# EAGLE design BigTime (EAGLE 9.3.0)
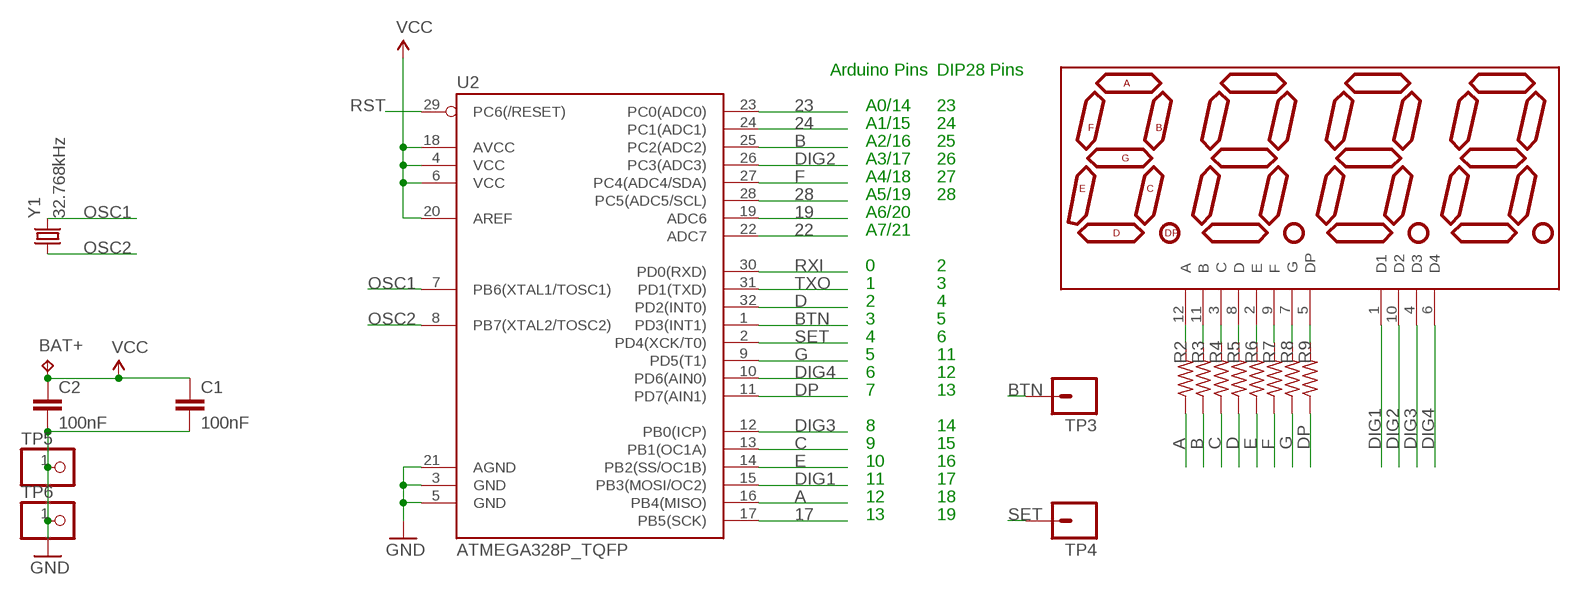
[diagram p0: schematic, sheet 1]

## Parts
BAT+  TPTP20R  [TP20R]
C1  100nF  C-EUC0805  [C0805]
C2  100nF  C-EUC0805  [C0805]
DISP1  7-SEGMENT-4DIGIT-COUNTER-HP-BUBBLE-SM  [DIL12_SM]
R2  330  R-US_R0805  [R0805]
R3  330  R-US_R0805  [R0805]
R4  330  R-US_R0805  [R0805]
R5  330  R-US_R0805  [R0805]
R6  330  R-US_R0805  [R0805]
R7  330  R-US_R0805  [R0805]
R8  330  R-US_R0805  [R0805]
R9  330  R-US_R0805  [R0805]
TP3  M01EDGE_CONTACT  [WATCHBTN]
TP4  M01EDGE_CONTACT  [WATCHBTN]
TP5  PINHD-1X1CB  [1X01-CLEANBIG]
TP6  PINHD-1X1CB  [1X01-CLEANBIG]
U2  ATMEGA328P_TQFP  [TQFP32-08]
Y1  32.768kHz  CRYSTALTC26H  [TC26H]

## Nets
17: U2.17(PB5(SCK))
19: U2.19(ADC6)
22: U2.22(ADC7)
23: U2.23(PC0(ADC0))
24: U2.24(PC1(ADC1))
28: U2.28(PC5(ADC5/SCL))
A: R2.1 U2.16(PB4(MISO))
A': DISP1.12(A) R2.2
B: R3.1 U2.25(PC2(ADC2))
B': DISP1.11(B) R3.2
BTN: TP3.1 U2.1(PD3(INT1))
C: R4.1 U2.13(PB1(OC1A))
C': DISP1.3(C) R4.2
D: R5.1 U2.32(PD2(INT0))
D': DISP1.8(D) R5.2
DIG1: DISP1.1(D1) U2.15(PB3(MOSI/OC2))
DIG2: DISP1.10(D2) U2.26(PC3(ADC3))
DIG3: DISP1.4(D3) U2.12(PB0(ICP))
DIG4: DISP1.6(D4) U2.10(PD6(AIN0))
DP: R9.1 U2.11(PD7(AIN1))
DP': DISP1.5(DP) R9.2
E: R6.1 U2.14(PB2(SS/OC1B))
E': DISP1.2(E) R6.2
F: R7.1 U2.27(PC4(ADC4/SDA))
F': DISP1.9(F) R7.2
G: R8.1 U2.9(PD5(T1))
G': DISP1.7(G) R8.2
GND: C1.2 C2.2 TP5.1 TP6.1 U2.3(GND) U2.5(GND) U2.21(AGND)
OSC1: U2.7(PB6(XTAL1/TOSC1)) Y1.2
OSC2: U2.8(PB7(XTAL2/TOSC2)) Y1.1
RST: U2.29(PC6(/RESET))
RXI: U2.30(PD0(RXD))
SET: TP4.1 U2.2(PD4(XCK/T0))
TXO: U2.31(PD1(TXD))
VCC: BAT+.TP C1.1 C2.1 U2.4(VCC) U2.6(VCC) U2.18(AVCC) U2.20(AREF)

## Notes on the sheet
- Arduino Pins | DIP28 Pins
- A0/14 | 23
- A1/15 | 24
- A2/16 | 25
- A3/17 | 26
- A4/18 | 27
- A5/19 | 28
- A6/20
- A7/21
- 0 | 2
- 1 | 3
- 2 | 4
- 3 | 5
- 4 | 6
- 5 | 11
- 6 | 12
- 7 | 13
- 8 | 14
- 9 | 15
- 10 | 16
- 11 | 17
- 12 | 18
- 13 | 19

## Library data of the parts
BAT+ = testpad:TP: Test pad
C1 C2 = resistor:C-EU: CAPACITOR, European symbol
DISP1 = BigTime:7-SEGMENT-4DIGIT-COUNTER: HP Bubble display, with pins bent under and clipped, for surface-mounting.
R2-R9 = resistor:R-US_: RESISTOR, American symbol
TP3 TP4 = Connectors:M01: Header 1 Standard 1-pin 0.1" header. Use with straight break away headers (SKU : PRT-00116), right angle break away headers (PRT-00553), swiss pins (PRT-00743), machine pins (PRT-00117), and female headers (PRT-00115). SMTSO-256-ET is a "flush mount" nut for a 4-40 screw. The older package used to be too tight, and did not allow it to sit properly thru the drill hit. The latest (0.165DIA) fits nice and snug.
TP5 TP6 = adafruit:PINHD-1X1: Pin header 1x1 for 0.1" spacing With round pins
U2 = SparkFun-DigitalIC:ATMEGA328P_TQFP; PROD_ID: IC-09069
Y1 = BigTime:CRYSTAL: CRYSTAL; OC_FARNELL: unknown; OC_NEWARK: unknown

## Board
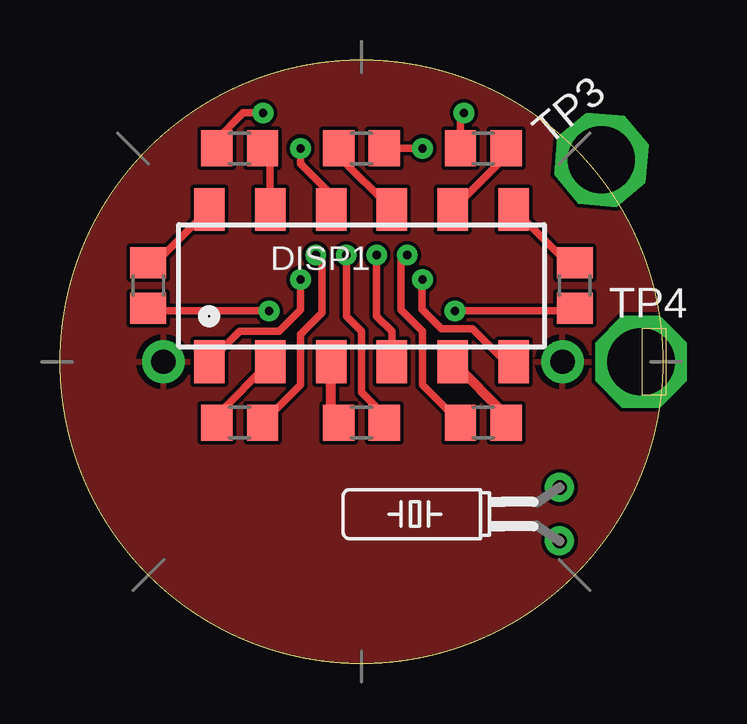
[diagram p1: board, top side]
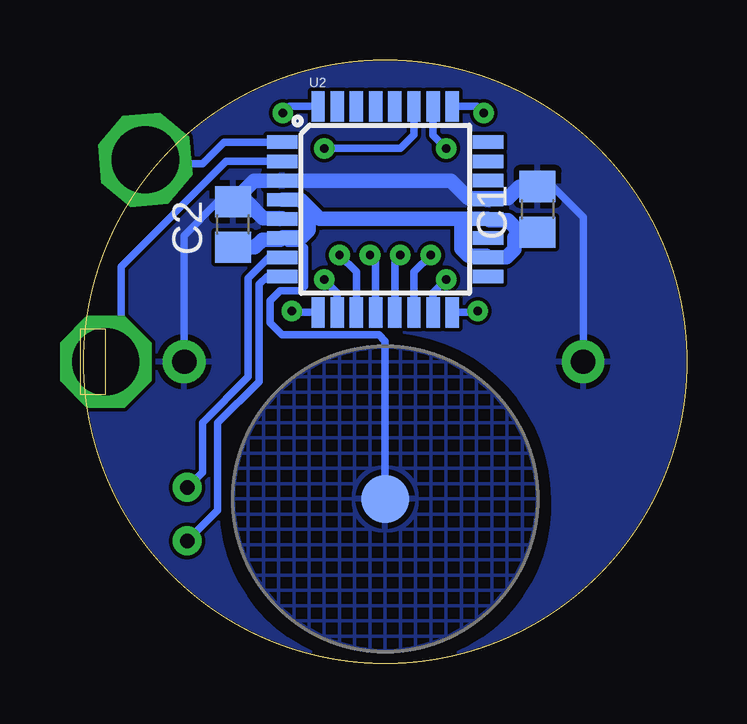
[diagram p2: board, bottom side, seen from below]

Size 25.27 x 25.15 mm. Coordinates in mm from the lower left corner, seen from the top.
Outline: circle at 12.57,12.57 radius 12.57
Copper layers (1*16): Top 0.0028mm / dielectric 30mil / Bottom 0.0028mm
Design rules "oshpark *": minimum track width 6mil, minimum drill 13mil, track to track 6mil, track to pad 6mil, pad to pad 6mil, via to via 6mil, smd to smd 6mil, copper to edge 1mil, drill to drill 6mil, minimum pad ring 12mil, minimum via ring 10mil, stop-mask expansion 4mil, vias tented up to drill 20mil, thermal gap 10mil

### Footprints (pad centres in the part's own frame; a part is rotated, then mirrored left to right if it is on the bottom)
TP20R = smd 2 x 2: TP 0,0
C0805 = smd 1.3 x 1.5: 1 -0.95,0; 2 0.95,0
DIL12_SM = smd 1.27 x 1.778: 1 -6.35,-3.175; 2 -3.81,-3.175; 3 -1.27,-3.175; 4 1.27,-3.175; 5 3.81,-3.175; 6 6.35,-3.175; 7 6.35,3.175; 8 3.81,3.175; 9 1.27,3.175; 10 -1.27,3.175; 11 -3.81,3.175; 12 -6.35,3.175
R0805 = smd 1.3 x 1.5: 1 -0.95,0; 2 0.95,0
WATCHBTN = drill 2.8 pad 3.81 octagon: 1 0,0
1X01-CLEANBIG = drill 1.016 pad 1.778: 1 0,0
TQFP32-08 = smd 1.27 x 0.559: 1 -4.293,2.8; 2 -4.293,2; 3 -4.293,1.2; 4 -4.293,0.4; 5 -4.293,-0.4; 6 -4.293,-1.2; 7 -4.293,-2; 8 -4.293,-2.8; 17 4.293,-2.8; 18 4.293,-2; 19 4.293,-1.2; 20 4.293,-0.4; 21 4.293,0.4; 22 4.293,1.2; 23 4.293,2; 24 4.293,2.8 | smd 0.559 x 1.27: 9 -2.8,-4.293; 10 -2,-4.293; 11 -1.2,-4.293; 12 -0.4,-4.293; 13 0.4,-4.293; 14 1.2,-4.293; 15 2,-4.293; 16 2.8,-4.293; 25 2.8,4.293; 26 2,4.293; 27 1.2,4.293; 28 0.4,4.293; 29 -0.4,4.293; 30 -1.2,4.293; 31 -2,4.293; 32 -2.8,4.293
TC26H = drill 0.6: 1 -1.114,-1.27; 2 1.114,-1.27

### Placement (x,y rotation side)
BAT+  12.57,6.86 0 bottom
C1  6.22,18.92 90 bottom
C2  18.92,18.29 90 bottom
DISP1  12.57,15.75 0 top
R2  3.68,15.75 90 top
R3  7.49,21.46 0 top
R4  12.57,10.03 180 top
R5  17.65,21.46 0 top
R6  7.49,10.03 180 top
R7  12.57,21.46 180 top
R8  21.46,15.75 90 top
R9  17.65,10.03 0 top
TP3  22.57,20.99 40 top
TP4  24.23,12.57 0 top
TP5  4.32,12.57 0 top
TP6  20.95,12.57 0 top
U2  12.57,18.92 0 bottom
Y1  19.56,6.22 90 top

### Tracks (layer width: path | path; a pad name or v marks a point on that pad's centre or on a via)
A  (via drill 0.35)
  Top 0.305: v8.72,14.69 3.79,14.69 R2.1
  Bottom 0.305: U2.16 8.78,14.63 v8.72,14.69
A'
  Top 0.305: DISP1.12 4,16.7 R2.2
B  (via drill 0.35)
  Top 0.305: R3.1 6.54,21.84 7.64,22.94 v8.47,22.94
  Bottom 0.305: U2.25 8.75,23.22 v8.47,22.94
B'
  Top 0.305: R3.2 8.76,21.14 DISP1.11
BTN
  Bottom 0.305: TP3.1 22.42,20.83 20.19,20.83 19.3,21.72 U2.1
C  (via drill 0.35)
  Top 0.305: v11.94,17.02 11.94,14.48 12.57,13.84 12.57,11.3 13.21,10.67 13.21,10.35 R4.1
  Bottom 0.305: U2.13 12.17,16.78 v11.94,17.02
C'
  Top 0.406: R4.2 11.3,10.35 DISP1.3
D  (via drill 0.35)
  Top 0.305: v16.84,22.94 16.7,22.8 R5.1
  Bottom 0.305: U2.32 16.57,23.22 v16.84,22.94
D'
  Top 0.305: DISP1.8 18.6,21.14 R5.2
DIG1  (via drill 0.35)
  Top 0.305: v10.03,16 10.03,14.74 9.14,13.84 7.49,13.84 DISP1.1
  Bottom 0.305: U2.15 10.57,15.46 v10.03,16
DIG2  (via drill 0.35)
  Top 0.305: 11.3,19.56 10.03,20.83 v10.03,21.46
  Top 0.406: DISP1.10 11.3,19.56
  Bottom 0.305: U2.26 10.57,22 v10.03,21.46
DIG3  (via drill 0.35)
  Top 0.305: v13.21,17.02 13.21,14.48 13.84,13.84 DISP1.4
  Bottom 0.305: U2.12 12.97,16.78 v13.21,17.02
DIG4  (via drill 0.35)
  Top 0.305: DISP1.6 18.58,12.57 17.2,13.95 15.91,13.95 15.1,14.77 v15.1,15.98 v15.11,16
  Bottom 0.305: U2.10 14.57,15.46 v15.11,16
DP  (via drill 0.35)
  Top 0.305: v14.48,17.02 14.22,16.76 14.22,14.74 15.11,13.84 15.11,11.62 R9.1
  Bottom 0.305: U2.11 13.77,16.31 v14.48,17.02
DP'
  Top 0.406: 16.38,13.21 DISP1.5 18.6,10.35 R9.2
E  (via drill 0.35)
  Top 0.305: v10.67,17.02 10.93,16.76 10.93,14.61 10.03,13.72 10.03,11.62 R6.1
  Bottom 0.305: U2.14 11.37,16.31 v10.67,17.02
E'
  Top 0.305: DISP1.2 6.54,10.35 R6.2
F  (via drill 0.35)
  Top 0.305: v15.11,21.46 R7.1
  Bottom 0.305: U2.27 11.37,22.03 11.94,21.46 v15.11,21.46
F'
  Top 0.305: DISP1.9 11.62,21.14 R7.2
G  (via drill 0.35)
  Top 0.305: v16.47,14.69 21.35,14.69 R8.1
  Bottom 0.305: U2.9 16.41,14.63 v16.47,14.69
G'
  Top 0.305: DISP1.7 21.15,16.7 R8.2
GND
  Bottom 0.305: C1.2 5.59,19.87 4.32,18.6 TP5.1 | C2.2 19.56,19.24 20.96,17.83 20.96,12.58 TP6.1
  Bottom 0.61: U2.5 16.9,18.56 17.66,18.56 18.34,19.24 C2.2 18.04,20.12 U2.3 9.84,20.12 9.11,19.39 8.22,19.39 | 8.22,19.39 7.46,19.39 6.97,19.87 C1.2 | 8.22,19.39 U2.21
  pour Top: 12.57,25.91 arc90 -0.76,12.57 arc90 12.57,-0.76 arc90 25.91,12.57 arc90
  pour Bottom: 12.57,25.3 arc90 -0.16,12.57 arc90 11.94,-0.13 arc-90 5.59,6.86 arc-90 12.57,13.84 arc-90 19.56,6.86 arc-90 13.21,-0.13 arc90 25.3,12.57 arc90
OSC1
  Bottom 0.305: Y1.2 20.19,7.97 20.19,10.03 18.29,11.94 18.29,16.05 17.41,16.92 U2.7
OSC2
  Bottom 0.305: U2.8 17.5,16.12 17.83,15.79 17.83,11.75 19.56,10.02 19.56,6.38 Y1.1
SET
  Bottom 0.305: TP4.1 23.59,13.21 23.59,16.54 19.21,20.92 U2.2
VCC
  Bottom 0.305: BAT+.TP 12.57,13.43 12.83,13.69 16.87,13.69 17.37,14.2 17.37,15.11 16.95,15.54 16.1,15.54 15.93,15.72 15.93,17.33 16.1,17.51 16.65,17.51 U2.6
  Bottom 0.61: C2.1 18.01,17.34 17.69,17.66 16.93,17.66 U2.6 16.83,17.76 16.07,17.76 15.77,18.05 15.77,18.99 | C1.1 6.97,17.97 | 15.77,18.99 16.04,19.26 16.11,19.32 U2.4 | 9.4,18.52 U2.20 8.22,18.46 7.46,18.46 6.97,17.97 | 9.4,18.52 15.3,18.52 15.77,18.99 | 6.97,17.97 7.19,17.75 7.19,17.25 7.52,16.92 U2.18 8.34,16.99 9.11,16.99 9.4,17.28 9.4,18.52
  pour Bottom (hatched): 12.57,13.21 arc90 6.22,6.86 arc90 12.57,0.51 arc90 18.92,6.86 arc90

### Text on the board
Document: N. Seidle